# EAGLE design smoggie (EAGLE 6.1)
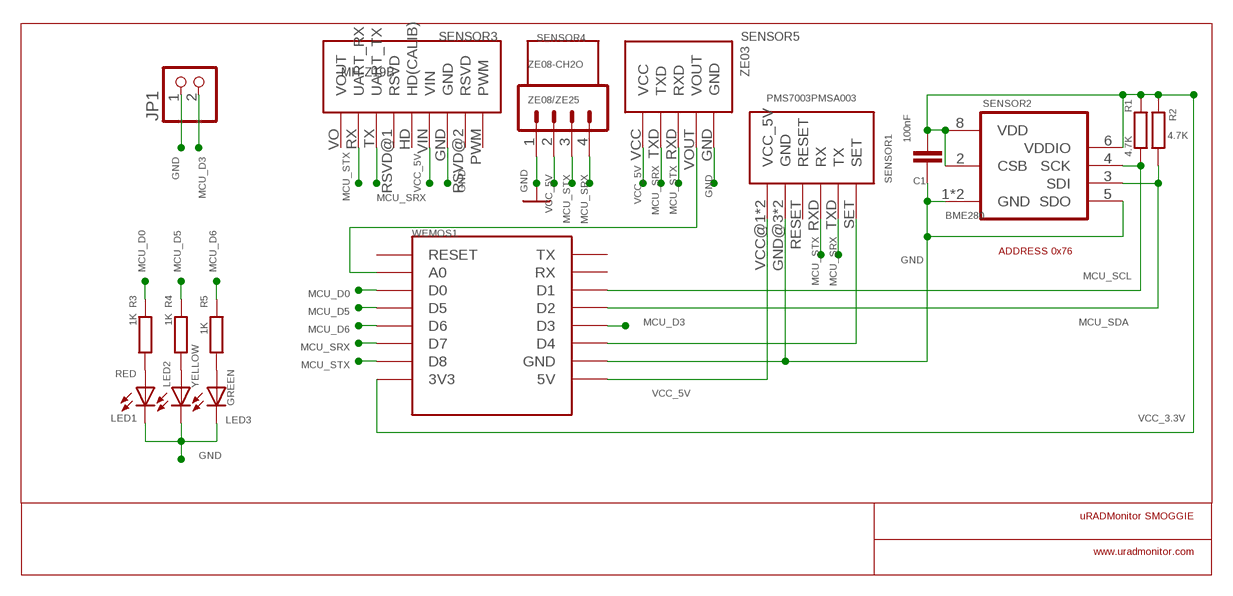
[diagram p0: schematic, sheet 1]

## Parts
C1  100nF  C-EUC0603  [C0603]
JP1  PINHD-1X2  [1X02]
LED1  RED  LEDSML0603  [SML0603]
LED2  YELLOW  LEDSML0603  [SML0603]
LED3  GREEN  LEDSML0603  [SML0603]
R1  4.7K  R-EU_R0603  [R0603]
R2  4.7K  R-EU_R0603  [R0603]
R3  1K  R-EU_R0603  [R0603]
R4  1K  R-EU_R0603  [R0603]
R5  1K  R-EU_R0603  [R0603]
SENSOR1  PMS7003PMSA003  [PMSA003]
SENSOR2  BME280  [BME280]
SENSOR3  MH-Z19B  [MH-Z19B]
SENSOR4  ZE08-CH2O  ZE08-CH2O_SENSOR  [ZE08-CH2O_SENSOR]
SENSOR5  ZE03  [ZE03]
WEMOS1  11  WEMOS-D1-MINI  [WEMOS-D1-MINI]
ZE08/ZE25  M041X04_NO_SILK  [1X04_NO_SILK]

## Nets
GND: C1.1 JP1.1 LED1.C LED2.C LED3.C SENSOR1.GND@3(GND) SENSOR1.GND@4(GND) SENSOR2.1(GND) SENSOR2.5(SDO) SENSOR2.7(GND) SENSOR3.GND SENSOR5.GND WEMOS1.GND ZE08/ZE25.1
MCU_D0: R3.1 WEMOS1.D0
MCU_D3: JP1.2 WEMOS1.D3
MCU_D5: R4.1 WEMOS1.D5
MCU_D6: R5.1 WEMOS1.D6
MCU_SCL: R1.2 SENSOR2.4(SCK) WEMOS1.D1
MCU_SDA: R2.2 SENSOR2.3(SDI) WEMOS1.D2
MCU_SRX: SENSOR1.TXD(TX) SENSOR3.TX(UART_TX) SENSOR5.TXD WEMOS1.D7 ZE08/ZE25.4
MCU_STX: SENSOR1.RXD(RX) SENSOR3.RX(UART_RX) SENSOR5.RXD WEMOS1.D8 ZE08/ZE25.3
N$1: LED2.A R4.2
N$3: LED3.A R5.2
N$4: SENSOR5.VOUT WEMOS1.A0
N$5: SENSOR1.SET WEMOS1.D4
N$6: LED1.A R3.2
VCC_3.3V: C1.2 R1.1 R2.1 SENSOR2.2(CSB) SENSOR2.6(VDDIO) SENSOR2.8(VDD) WEMOS1.3V3
VCC_5V: SENSOR1.VCC@1(VCC_5V) SENSOR1.VCC@2(VCC_5V) SENSOR3.VIN SENSOR5.VCC WEMOS1.5V ZE08/ZE25.2
Unconnected: SENSOR1.RESET SENSOR3.HD(HD(CALIB)) SENSOR3.PWM SENSOR3.RSVD@1(RSVD) SENSOR3.RSVD@2(RSVD) SENSOR3.VO(VOUT) WEMOS1.RESET WEMOS1.RX WEMOS1.TX

## Notes on the sheet
- ADDRESS 0x76
- uRADMonitor SMOGGIE
- www.uradmonitor.com

## Library data of the parts
C1 = rcl:C-EU: CAPACITOR, European symbol
JP1 = pinhead:PINHD-1X2: PIN HEADER
LED1-LED3 = led:LED: LED OSRAM: - CHIPLED LG R971, LG N971, LY N971, LG Q971, LY Q971, LO R971, LY R971 LH N974, LH R974 LS Q976, LO Q976, LY Q976 LO Q996 - Hyper CHIPLED LW Q18S LB Q993, LB Q99A, LB R99A - SideLED LS A670, LO A670, LY A670, LG A670, LP A670 LB A673, LV A673, LT A673, LW A673 LH A674 LY A675 LS A676, LA A676, LO A676, LY A676, LW A676 LS A679, LY A679, LG A679 - Hyper Micro SIDELED® LS Y876, LA Y876, LO Y876, LY Y876 LT Y87S - SmartLED LW L88C, LW L88S LB L89C, LB L89S, LG L890 LS L89K, LO L89K, LY L89K LS L896, LA L896, LO L896, LY L896 - TOPLED LS T670, LO T670, LY T670, LG T670, LP T670 LSG T670, LSP T670, LSY T670, LOP T670, LYG T670 LG T671, LOG T671, LSG T671 LB T673, LV T673, LT T673, LW T673 LH T674 LS T676, LA T676, LO T676, LY T676, LB T676, LH T676, LSB T676, LW T676 LB T67C, LV T67C, LT T67C, LS T67K, LO T67K, LY T67K, LW E67C LS E67B, LA E67B, LO E67B, LY E67B, LB E67C, LV E67C, LT E67C LW T67C LS T679, LY T679, LG T679 LS T770, LO T770, LY T770, LG T770, LP T770 LB T773, LV T773, LT T773, LW T773 LH T774 LS E675, LA E675, LY E675, LS T675 LS T776, LA T776, LO T776, LY T776, LB T776 LHGB T686 LT T68C, LB T68C - Hyper Mini TOPLED® LB M676 - Mini TOPLED Santana® LG M470 LS M47K, LO M47K, LY M47K Source: http://www.osram.convergy.de LUXEON: - LUMILED® LXK2-PW12-R00, LXK2-PW12-S00, LXK2-PW14-U00, LXK2-PW14-V00 LXK2-PM12-R00, LXK2-PM12-S00, LXK2-PM14-U00 LXK2-PE12-Q00, LXK2-PE12-R00, LXK2-PE12-S00, LXK2-PE14-T00, LXK2-PE14-U00 LXK2-PB12-K00, LXK2-PB12-L00, LXK2-PB12-M00, LXK2-PB14-N00, LXK2-PB14-P00, LXK2-PB14-Q00 LXK2-PR12-L00, LXK2-PR12-M00, LXK2-PR14-Q00, LXK2-PR14-R00 LXK2-PD12-Q00, LXK2-PD12-R00, LXK2-PD12-S00 LXK2-PH12-R00, LXK2-PH12-S00 LXK2-PL12-P00, LXK2-PL12-Q00, LXK2-PL12-R00 Source: www.luxeon.com KINGBRIGHT: KA-3528ASYC Source: www.kingbright.com
R1-R5 = resistor:R-EU_: RESISTOR, European symbol
SENSOR1 = uradmonitor:PMS7003: Plantower PMS-7003 Air Quality Sensor for PM0.3, PM0.5, PM1.0, PM2.5, PM5.0, PM10.0 Key Features ◆ laser scattering principle to achieve accurate measurement ◆ zero error alarm rate ◆ real-time response and support continuous acquisition ◆ minimum resolution particle size 0.3μ m ◆ new patent structure, six full range of shielding, anti-jamming performance stronger ◆ The direction of the inlet and outlet can be selected, the scope of application is wide and the user does not need to design the air duct again ◆ ultra-thin design, only 12 mm, suitable for portable devices Overview PMS7003 is a digital versatile particle concentration sensor based on the principle of laser scattering, continuous mining And calculate the number of suspended particles in different sizes of air in the unit volume, that is, the concentration distribution of particles, And converted into mass concentration, and in the form of general digital interface output. The sensor can be embedded in a variety of air Suspended particle concentration in the instrument or environmental improvement equipment, to provide timely and accurate concentration according to.
SENSOR2 = uradmonitor:BME280: DIGITAL HUMIDITY, PRESSURE AND TEMPERATURE SENSOR * Digital interface IÂ²C (up to 3.4 MHz) and SPI (3 and 4 wire, up to 10 MHz)* Supply voltage VDD main supply voltage range: 1.71 V to 3.6 V*VDDIO interface voltage range: 1.2 V to 3.6 V Operating range -40â€¦+85 Â°C, 0â€¦100 % rel. humidity, 300â€¦1100 hPa
SENSOR3 = uradmonitor:MH-Z19B: Winsensor CO2 NDIR sensor
SENSOR4 = uradmonitor:ZE08-CH2O_SENSOR
SENSOR5 = uradmonitor:ZE03: Winsensor ZE03 sensor for CO, NO2, SO2, O3, Cl2, H2S, NH3, etc
WEMOS1 = esp8266modules_2:WEMOS-D1-MINI: WeMos.cc D1 mini ESP8266 module
ZE08/ZE25 = sparkfun-connectors:M04: Header 4 Standard 4-pin 0.1" header. Use with straight break away headers (SKU : PRT-00116), right angle break away headers (PRT-00553), swiss pins (PRT-00743), machine pins (PRT-00117), and female headers (PRT-00115). Molex polarized connector foot print use with SKU : PRT-08231 with associated crimp pins and housings. 1MM SMD Version SKU: PRT-10208

## Board
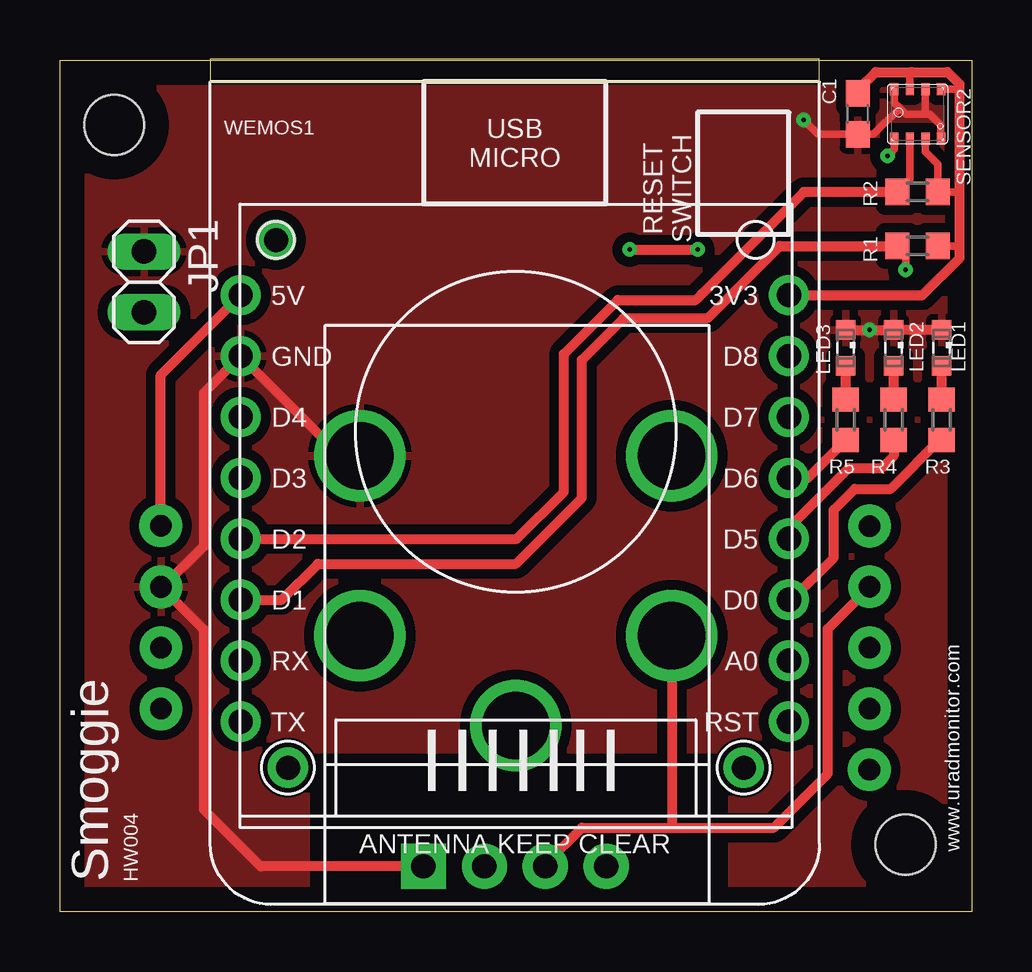
[diagram p1: board, top side]
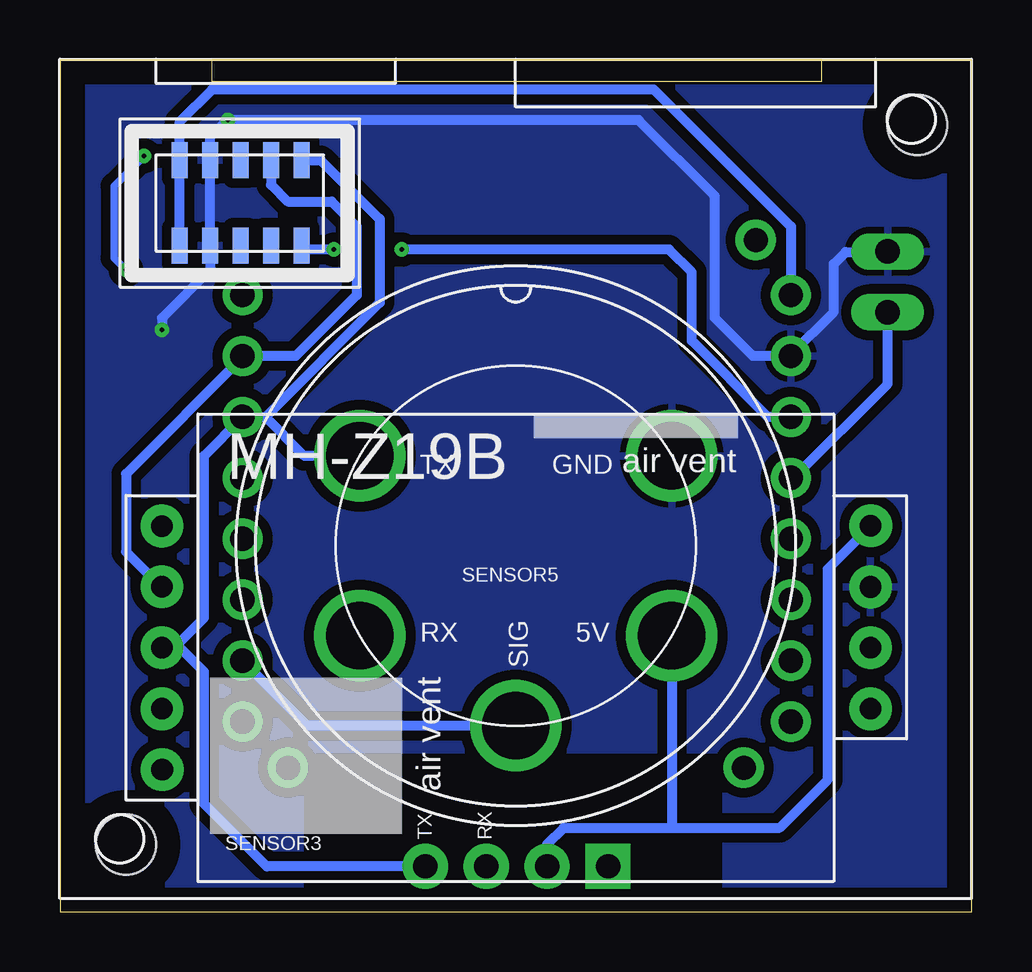
[diagram p2: board, bottom side, seen from below]

Size 38 x 35.5 mm. Coordinates in mm from the lower left corner, seen from the top.
Outline: 0,35.5 38,35.5 38,0 0,0 0,35.5
Copper layers (1*16): Top 0.035mm / dielectric 1.5mm / Bottom 0.035mm
Design rules: minimum track width 10mil, minimum drill 24mil, track to track 8mil, track to pad 8mil, pad to pad 8mil, via to via 8mil, smd to smd 8mil, copper to edge 40mil, drill to drill 8mil, minimum pad ring 10mil, minimum via ring 8mil, stop-mask expansion 4mil, vias tented up to drill 0mil, thermal gap 10mil
Holes 2.5 mm at 2.26,32.79 35.26,2.79
Milling: 4 lines

### Footprints (pad centres in the part's own frame; a part is rotated, then mirrored left to right if it is on the bottom)
C0603 = smd 1.1 x 1: 1 -0.85,0; 2 0.85,0
1X02 = drill 1.016 long: 1 -1.27,0; 2 1.27,0
SML0603 = smd 0.8 x 0.8: A 0.75,0; C -0.75,0
R0603 = smd 1 x 1.1: 1 -0.85,0; 2 0.85,0
PMSA003 = smd 0.66 x 1.5: GND@3 6.27,-4.215; GND@4 6.27,-7.79; NC1 7.54,-7.79; NC2 8.81,-7.79; RESET 7.54,-4.215; RXD 8.81,-4.215; SET 10.08,-7.79; TXD 10.08,-4.215; VCC@1 5,-4.215; VCC@2 5,-7.79
BME280 = smd 0.35 x 0.5: 1 0.975,-1.025; 2 0.325,-1.025; 3 -0.325,-1.025; 4 -0.975,-1.025; 5 -0.975,1.025; 6 -0.325,1.025; 7 0.325,1.025; 8 0.975,1.025
MH-Z19B = drill 0.9 pad 1.778: GND -10.04,-6.28; HD 19.49,1.34; PWM -10.04,-1.2; RSVD@1 19.5,-1.2; RSVD@2 -10.04,-3.75; RX 19.5,-6.29; TX 19.5,-3.75; VIN -10.05,-8.83; VO 19.5,-8.82
ZE03 = drill 2.8: GND 6.5,3.75; RXD -6.5,-3.75; TXD -6.5,3.75; VCC 6.5,-3.75; VOUT 0,-7.5
WEMOS-D1-MINI = drill 1.016 pad 1.676: 3V3 -10.16,-10.16; 5V 12.7,-10.16; A0 -10.16,5.08; D0 -10.16,2.54; D1 12.7,2.54; D2 12.7,0; D3 12.7,-2.54; D4 12.7,-5.08; D5 -10.16,0; D6 -10.16,-2.54; D7 -10.16,-5.08; D8 -10.16,-7.62; GND 12.7,-7.62; RESET -10.16,7.62; RX 12.7,5.08; TX 12.7,7.62
1X04_NO_SILK = drill 1.016 pad 1.88 square: 1 0,0 | drill 1.016 pad 1.88: 2 2.54,0; 3 5.08,0; 4 7.62,0

### Placement (x,y rotation side)
C1  33.25,33.25 90 top
JP1  3.5,26.25 270 top
LED1  36.75,23.5 270 top
LED2  34.75,23.5 270 top
LED3  32.75,23.5 270 top
R1  35.75,27.75 180 top
R2  35.75,30 180 top
R3  36.75,20.5 90 top
R4  34.75,20.5 90 top
R5  32.75,20.5 90 top
SENSOR1  38.01,35.54 0 bottom
SENSOR2  35.75,33.25 0 top
SENSOR3  14.25,7.25 180 bottom
SENSOR4  15.5,22.5 0 top
SENSOR5  19,15.25 0 bottom
WEMOS1  20.23,15.54 180 top
ZE08/ZE25  15.15,1.88 0 top

### Tracks (layer width: path | path; a pad name or v marks a point on that pad's centre or on a via)
GND  (via drill 0.2 pad 0.2)
  Top 0.305: SENSOR2.5 34.78,33.72 35,33.5 | 35,33.5 35.25,33.25 36,33.25 | SENSOR2.1 36.72,32.77 36.25,33.25 36,33.25 | SENSOR2.7 36.08,33.33 36,33.25 | 35,33.5 33.9,32.4 C1.1 31.6,32.4 v31,33
  Top 0.406: ZE08/ZE25.1 8.36,1.88 6,4.25 6,11.74 SENSOR3.GND 4.28,13.53 6,15.25 6,21.63 WEMOS1.GND 11.69,19 SENSOR5.GND | LED1.C LED2.C v33.75,24.25 LED3.C
  Bottom 0.305: 31.74,32.28 31.72,32.28 v31,33
  Bottom 0.406: v33.75,24.25 33.75,24.75 31.74,26.76 SENSOR1.GND@4 SENSOR1.GND@3 31.74,32.28 31.03,33 v31,33 13.88,33 10.7,29.83 10.7,24.74 9.12,23.16 WEMOS1.GND 7.53,23.22 5.75,25 5.75,27 5.25,27.5 3.52,27.5 JP1.1
  pour Top (isolate 0.406): 0,35.5 0,0 10.25,0 10.25,6.75 28,6.75 28,0 38,0 38,35.5
  pour Bottom (isolate 0.406): 0,35.5 38,35.5 38,0 28,0 28,6.75 10.25,6.75 10.25,0 0,0
MCU_D0
  Top 0.406: WEMOS1.D0 30.5,13 32.25,14.75 32.25,16.75 33.12,17.62 34.62,17.62 36.65,19.65 R3.1
MCU_D3
  Bottom 0.406: WEMOS1.D3 7.42,18.08 3.5,22 JP1.2
MCU_D5
  Top 0.406: R4.1 34.75,19 34.25,18.5 32.88,18.5 30.38,16 30.38,15.62 30.39,15.61 WEMOS1.D5
MCU_D6
  Top 0.406: WEMOS1.D6 31.18,18.08 R5.1
MCU_SCL  (via drill 0.2 pad 0.2)
  Top 0.305: SENSOR2.4 34.78,31.77 v34.5,31.5 | v35.25,26.75 35.25,27.4 R1.2
  Top 0.406: R1.2 30,27.75 27,24.75 23.5,24.75 21.75,23 21.75,17.25 19,14.5 10.75,14.5 9.25,13 WEMOS1.D1
  Bottom 0.305: v34.5,31.5 35.75,30.25 35.75,27.25 v35.25,26.75
MCU_SDA
  Top 0.305: SENSOR2.3 35.42,30.52 R2.2
  Top 0.406: R2.2 31,30 26.75,25.75 26.5,25.5 23.25,25.5 21,23.25 21,17.5 19.04,15.54 WEMOS1.D2
MCU_SRX
  Bottom 0.305: 33.25,11 33.12,11.12 | WEMOS1.D7
  Bottom 0.406: SENSOR1.TXD 27.13,31.33 24.67,28.87 24.67,25.38 29.44,20.62 | WEMOS1.D7 29.44,20.62 | SENSOR3.TX 33.25,11 | WEMOS1.D7 32,19 32,12.25 33.12,11.12 32,10 32,4.5 29.39,1.88 ZE08/ZE25.4 | SENSOR5.TXD 27.82,19 29.44,20.62
MCU_STX
  Top 0.305: SENSOR3.RX 33.71,13.54 | ZE08/ZE25.3 20.23,1.98
  Top 0.406: 20.23,1.98 21.75,3.5 25.5,3.5 | 25.5,3.5 29.75,3.5 32,5.75 32,11.79 SENSOR3.RX | SENSOR5.RXD 25.5,3.5
  Bottom 0.406: SENSOR1.RXD 29.2,30.29 28.51,29.6 26.67,29.6 25.63,28.55 25.63,25.7 28.17,23.16 WEMOS1.D8 30.39,23.11 35.25,18.25 35.25,15 33.75,13.5 SENSOR3.RX
N$1
  Top 0.406: R4.2 LED2.A
N$3
  Top 0.406: R5.2 LED3.A
N$4
  Bottom 0.406: SENSOR5.VOUT 27.68,7.75 WEMOS1.A0
N$5  (via drill 0.2 pad 0.2)
  Top 0.406: v23.75,27.6 v26.58,27.6
  Bottom 0.406: WEMOS1.D4 8.48,20.62 11.66,23.79 11.66,26.65 12.61,27.6 v23.75,27.6 | v26.58,27.6 27.78,27.6 SENSOR1.SET
N$6
  Top 0.406: R3.2 LED1.A
SOLDER1  (via drill 1 pad 1.68)
  other vias: 9,28
SOLDER2  (via drill 1 pad 1.68)
  other vias: 9.5,6
SOLDER3  (via drill 1 pad 1.68)
  other vias: 28.5,6
VCC_3.3V
  Top 0.305: C1.2 33.35,34.35 | 37.5,34.25 37.47,34.28 SENSOR2.8 | SENSOR2.6 35.42,34.92 35.5,35 | SENSOR2.2 36.08,31.67 36.6,31.15 R2.1 37.5,30 | R1.1 37.5,27.75
  Top 0.406: 33.35,34.35 34,35 35.5,35 37,35 37.5,34.5 37.5,34.25 37.5,30 37.5,27.75 37.5,27.25 35.95,25.7 WEMOS1.3V3
VCC_5V
  Top 0.406: SENSOR3.VIN 4.2,22.37 WEMOS1.5V
  Bottom 0.406: SENSOR1.VCC@2 SENSOR1.VCC@1 33.01,32.92 31.66,34.27 13.25,34.27 7.53,28.55 WEMOS1.5V 7.45,25.7 | ZE08/ZE25.2 17.69,2.81 17,3.5 12.5,3.5 | 12.5,3.5 8,3.5 6,5.5 6,14.28 SENSOR3.VIN | SENSOR5.VCC 12.5,3.5

### Text on the board
tNames: www.uradmonitor.com | Smoggie | HW004
bNames: RX | TX